# Altium schematic sheet Surf5.SchDoc
size A3; SheetNumber: 1; SheetTotal: 1
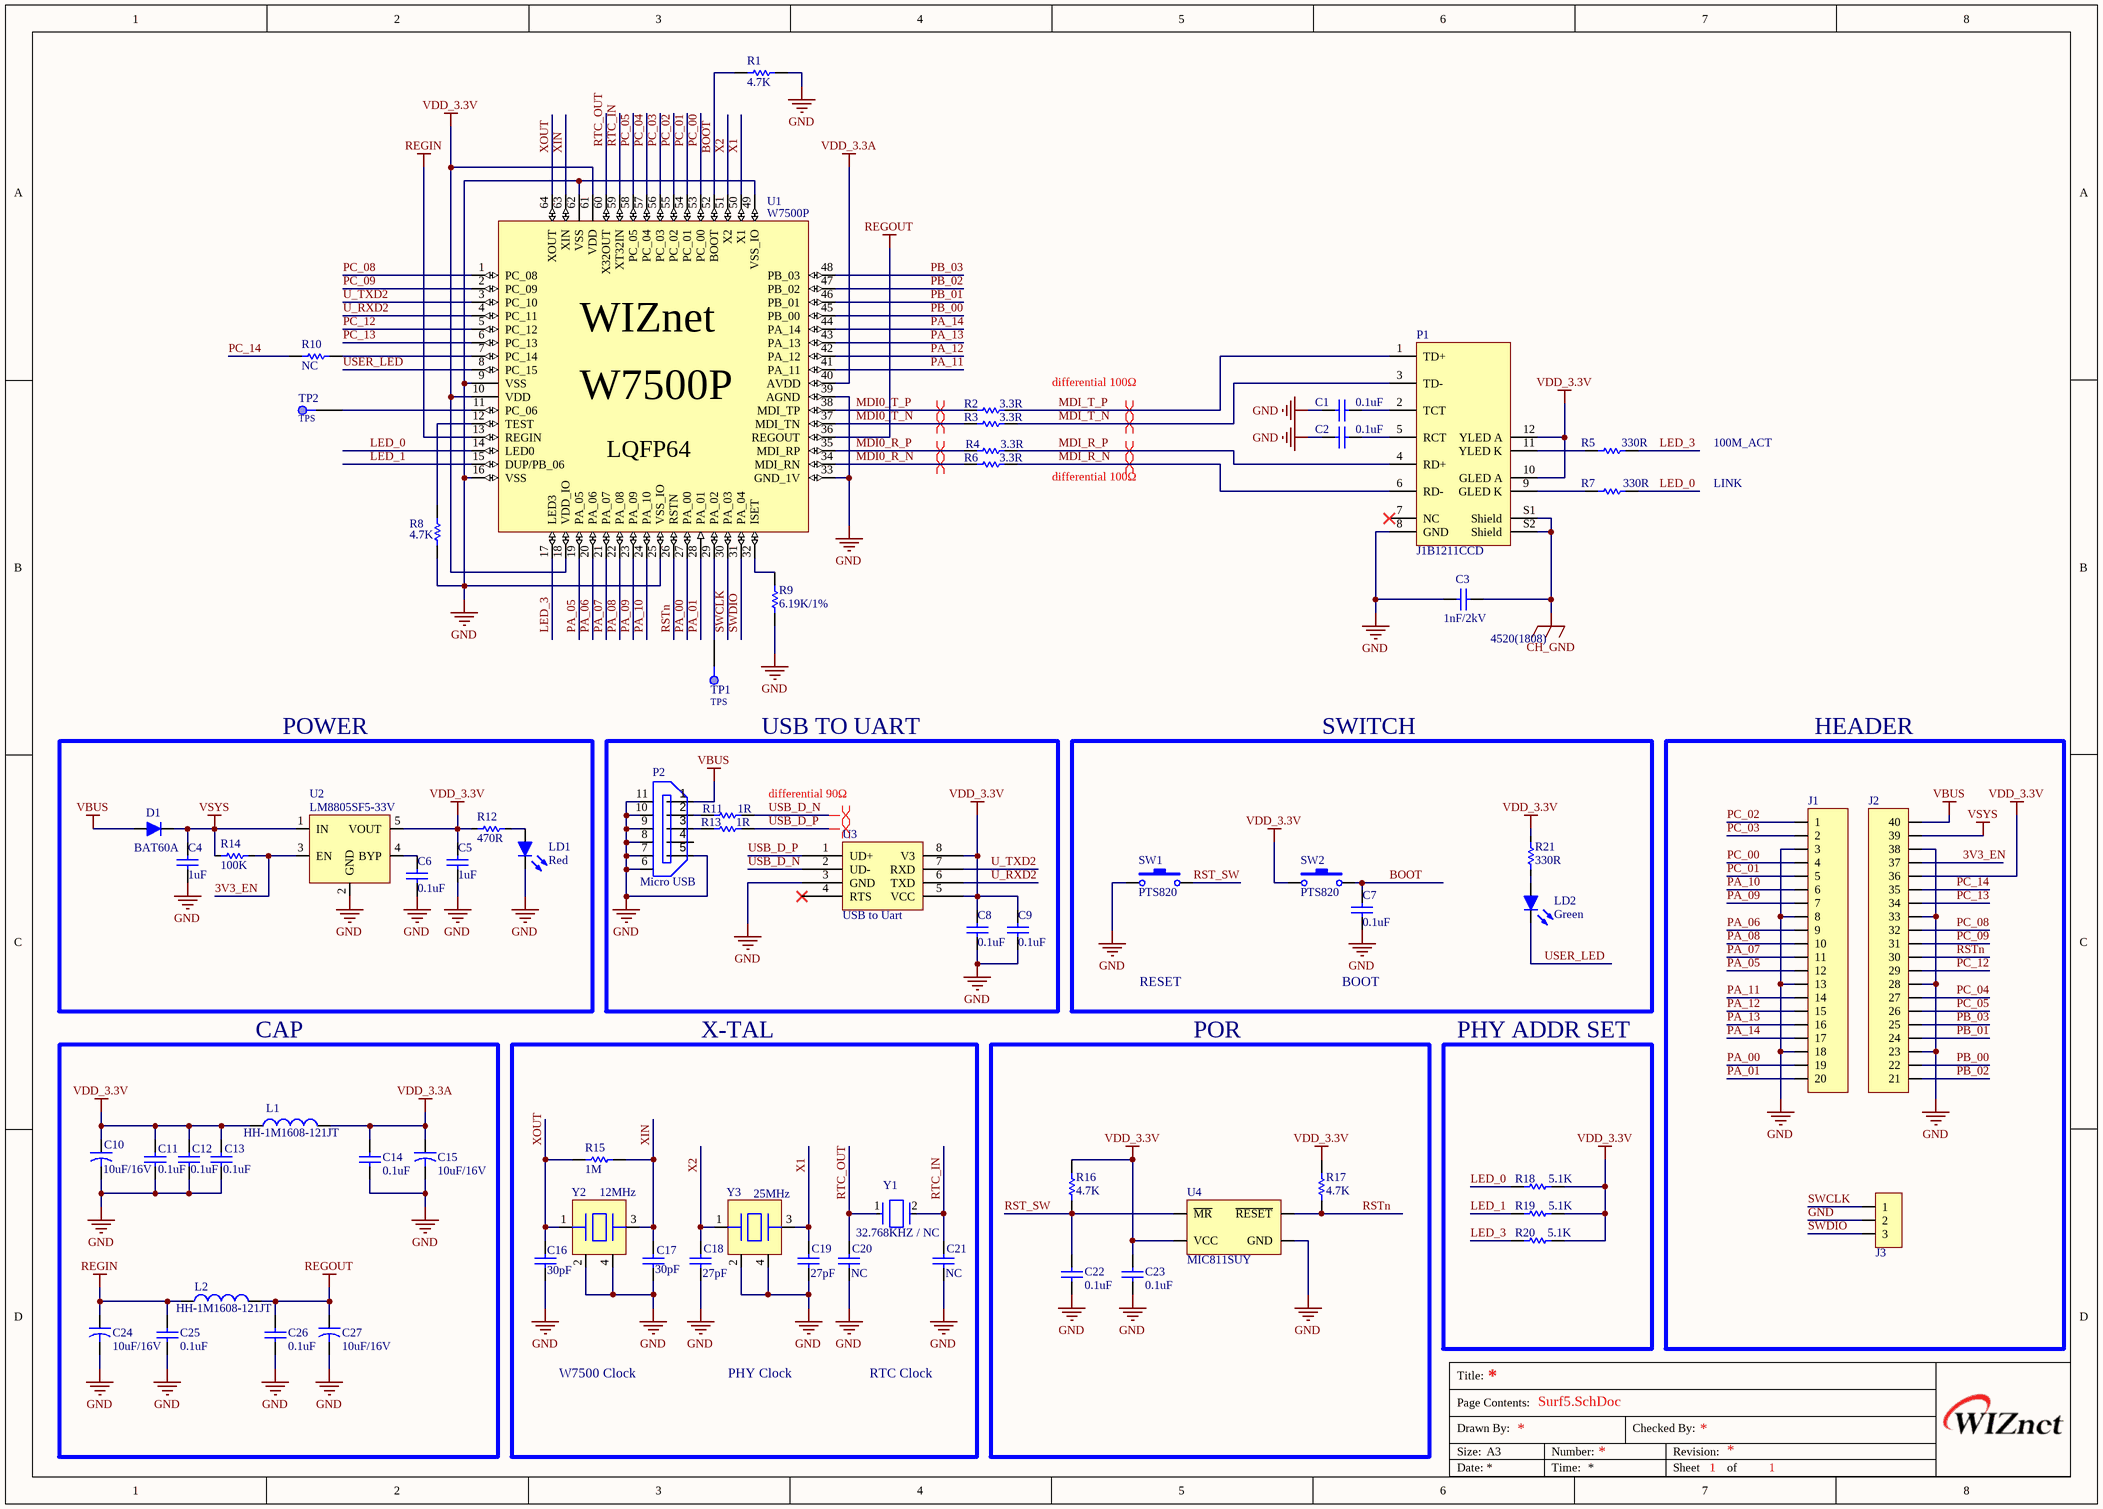
[diagram p0: Surf5.SchDoc]

## Parts
C1  0.1uF  [CAP-0402]
C2  0.1uF  [CAP-0402]
C3  1nF/2kV  [CAP-1808]
C4  1uF  [CAP-0402]
C5  1uF  [CAP-0402]
C6  0.1uF  [CAP-0402]
C7  0.1uF  [CAP-0402]
C8  0.1uF  [CAP-0402]
C9  0.1uF  [CAP-0402]
C10  10uF/16V  [CAP-A Size]
C11  0.1uF  [CAP-0402]
C12  0.1uF  [CAP-0402]
C13  0.1uF  [CAP-0402]
C14  0.1uF  [CAP-0402]
C15  10uF/16V  [CAP-A Size]
C16  30pF  [CAP-0402]
C17  30pF  [CAP-0402]
C18  27pF  [CAP-0402]
C19  27pF  [CAP-0402]
C20  NC  [CAP-0402]
C21  NC  [CAP-0402]
C22  0.1uF  [CAP-0402]
C23  0.1uF  [CAP-0402]
C24  10uF/16V  [CAP-A Size]
C25  0.1uF  [CAP-0402]
C26  0.1uF  [CAP-0402]
C27  10uF/16V  [CAP-A Size]
D1  BAT60A  [SOD-323(1-C,2-A)]
J1  2.54mm 1x20 Pin Header DIP  [IDC-1X20]  (value not drawn)
J2  2.54mm 1x20 Pin Header DIP  [IDC-1X20]  (value not drawn)
J3  2.54mm 1x3 Pin Header DIP  [idc-1x3]  (value not drawn)
L1  HH-1M1608-121JT  [IND-0603]
L2  HH-1M1608-121JT  [IND-0603]
LD1  Red  [LED-0603-RED]
LD2  Green  [LED-0603-RED]
P1  J1B1211CCD  [RJ45-J1B1211CCD]
P2  Micro USB  [Micro 5P B DBX 6.4]
R1  4.7K  [RES-0402]
R2  3.3R  [RES-0402]
R3  3.3R  [RES-0402]
R4  3.3R  [RES-0402]
R5  330R  [RES-0402]
R6  3.3R  [RES-0402]
R7  330R  [RES-0402]
R8  4.7K  [RES-0402]
R9  6.19K/1%  [RES-0402]
R10  NC  [RES-0402]
R11  1R  [RES-0402]
R12  470R  [RES-0402]
R13  1R  [RES-0402]
R14  100K  [RES-0402]
R15  1M  [RES-0402]
R16  4.7K  [RES-0402]
R17  4.7K  [RES-0402]
R18  5.1K  [RES-0402]
R19  5.1K  [RES-0402]
R20  5.1K  [RES-0402]
R21  330R  [RES-0402]
SW1  PTS820  [1185A]
SW2  PTS820  [1185A]
TP1  TPS  [TPS]
TP2  TPS  [TPS]
U1  W7500P  [W7500-LQFP64]
U2  LM8805SF5-33V  [SOT-23-5L]
U3  USB to Uart  [CH340N]
U4  MIC811SUY  [SOT-143]
Y1  32.768KHZ / NC  [3215_XTAL]
Y2  12MHz  [OSC-TZ1067B]
Y3  25MHz  [OSC-82J0626]

## Blocks framed on the sheet
POWER: C4-C6 D1 LD1 R12 R14 U2
USB TO UART: C8 C9 P2 R11 R13 U3
SWITCH: C7 LD2 R21 SW1 SW2
HEADER: J1-J3
CAP: C10-C15 C24-C27 L1 L2
X-TAL: C16-C21 R15 Y1-Y3
POR: C22 C23 R16 R17 U4
PHY ADDR SET: R18-R20

## Nets
CH_GND: C3.2 P1.S1(Shield) P1.S2(Shield)
GND: C1.1 C2.1 C3.1 C4.1 C5.1 C6.1 C7.1 C8.1 C9.1 C10.2 C11.1 C12.1 C13.1 C14.1 C15.2 C16.1 C17.1 C18.1 C19.1 C20.1 C21.1 C22.2 C23.2 C24.2 C25.1 C26.1 C27.2 J1.3 J1.8 J1.13 J1.18 J2.3(23) J2.8(28) J2.13(33) J2.18(38) J3.2 LD1.2(K) P1.8(GND) P2.5 P2.6 P2.7 P2.8 P2.9 P2.10 P2.11 R1.1 R8.1 R9.1 SW1.1 U1.9(VSS) U1.16(VSS) U1.25(VSS_IO) U1.33(GND_1V) U1.39(AGND) U1.49(VSS_IO) U1.62(VSS) U2.2(GND) U3.3(GND) U4.1(GND) Y2.2 Y2.4 Y3.2 Y3.4
REGIN: C24.1 C25.2 L2.1 U1.13(REGIN)
REGOUT: C26.2 C27.1 L2.2 U1.36(REGOUT)
VBUS: D1.2(A) J2.20(40) P2.1
VDD_3.3A: C14.2 C15.1 L1.2 U1.40(AVDD)
VDD_3.3V: C5.2 C8.2 C9.2 C10.1 C11.2 C12.2 C13.2 C23.1 J2.16(36) L1.1 P1.10(GLED_A) P1.12(YLED_A) R12.1 R16.2 R17.1 R18.2 R19.2 R20.2 R21.2 SW2.1 U1.10(VDD) U1.18(VDD_IO) U1.61(VDD) U2.5(VOUT) U3.5(VCC) U3.8(V3) U4.4(VCC)
VSYS: C4.2 D1.1(K) J2.19(39) R14.1 U2.1(IN)
3V3_EN: J2.17(37) R14.2 U2.3(EN)
BOOT: C7.2 R1.2 SW2.2 U1.52(BOOT)
LED_0: R7.2 R18.1 U1.14(LED0)
LED_1: R19.1 U1.15(DUP/PB_06)
LED_3: R5.2 R20.1 U1.17(LED3)
MDI0_R_N: R6.1 U1.34(MDI_RN)
MDI0_R_P: R4.1 U1.35(MDI_RP)
MDI0_T_N: R3.1 U1.37(MDI_TN)
MDI0_T_P: R2.1 U1.38(MDI_TP)
MDI_R_N: P1.6(RD-) R6.2
MDI_R_P: P1.4(RD+) R4.2
MDI_T_N: P1.3(TD-) R3.2
MDI_T_P: P1.1(TD+) R2.2
PA_00: J1.19 U1.27(PA_00)
PA_01: J1.20 U1.28(PA_01)
PA_05: J1.12 U1.19(PA_05)
PA_06: J1.9 U1.20(PA_06)
PA_07: J1.11 U1.21(PA_07)
PA_08: J1.10 U1.22(PA_08)
PA_09: J1.7 U1.23(PA_09)
PA_10: J1.6 U1.24(PA_10)
PA_11: J1.14 U1.41(PA_11)
PA_12: J1.15 U1.42(PA_12)
PA_13: J1.16 U1.43(PA_13)
PA_14: J1.17 U1.44(PA_14)
PB_00: J2.2(22) U1.45(PB_00)
PB_01: J2.4(24) U1.46(PB_01)
PB_02: J2.1(21) U1.47(PB_02)
PB_03: J2.5(25) U1.48(PB_03)
PC_00: J1.4 U1.53(PC_00)
PC_01: J1.5 U1.54(PC_01)
PC_02: J1.1 U1.55(PC_02)
PC_03: J1.2 U1.56(PC_03)
PC_04: J2.7(27) U1.57(PC_04)
PC_05: J2.6(26) U1.58(PC_05)
PC_08: J2.12(32) U1.1(PC_08)
PC_09: J2.11(31) U1.2(PC_09)
PC_12: J2.9(29) U1.5(PC_12)
PC_13: J2.14(34) U1.6(PC_13)
PC_14: J2.15(35) R10.1
RST_SW: C22.1 R16.1 SW1.2 U4.3(~{MR})
RSTn: J2.10(30) R17.2 U1.26(RSTN) U4.2(~{RESET})
RTC_IN: C21.2 U1.59(XT32IN) Y1.2
RTC_OUT: C20.2 U1.60(X32OUT) Y1.1
SWCLK: J3.1 U1.30(PA_03)
SWDIO: J3.3 U1.31(PA_04)
U_RXD2: U1.4(PC_11) U3.6(TXD)
U_TXD2: U1.3(PC_10) U3.7(RXD)
USB_D_N: R11.2 U3.2(UD-)
USB_D_P: R13.2 U3.1(UD+)
USER_LED: LD2.2(K) U1.8(PC_15)
X1: C19.2 U1.50(X1) Y3.3
X2: C18.2 U1.51(X2) Y3.1
XIN: C17.2 R15.2 U1.63(XIN) Y2.3
XOUT: C16.2 R15.1 U1.64(XOUT) Y2.1
NetC1_2: C1.2 P1.2(TCT)
NetC2_2: C2.2 P1.5(RCT)
NetC6_2: C6.2 U2.4(BYP)
NetLD1_1: LD1.1(A) R12.2
NetLD2_1: LD2.1(A) R21.1
NetP1_9: P1.9(GLED_K) R7.1
NetP1_11: P1.11(YLED_K) R5.1
NetP2_2: P2.2 R11.1
NetP2_3: P2.3 R13.1
NetR8_2: R8.2 U1.12(TEST)
NetR9_2: R9.2 U1.32(ISET)
NetR10_2: R10.2 U1.7(PC_14)
NetTP1_1: TP1.1 U1.29(PA_02)
NetTP2_1: TP2.1 U1.11(PC_06)

Not connected (* = marked no-connect by the designer): P1 7(NC)*; P2 4; U3 4(RTS)*

## Layout directives
differential pair: MDI0_R_N, MDI0_R_P, MDI0_T_N, MDI0_T_P, MDI_R_N, MDI_R_P, MDI_T_N, MDI_T_P, USB_D_N, USB_D_P

## Notes on the sheet
- differential 100Ω
- 100M_ACT
- LINK
- (near C3) 4520(1808)
- differential 90Ω
- RESET
- BOOT
- W7500 Clock
- PHY Clock
- RTC Clock
- Title:
- Page Contents:
- Size:
- Date:
- Drawn By:
- A3
- Number:
- Time:
- Checked By:
- Revision:
- Sheet
- of
- (in symbol W7500P) WIZnet; LQFP64

## Library data of the parts
C1 C2 C4-C9 C11-C14 C16-C23 C25 C26 = CAP-0402: Ceramic CAP 0402(1005)
C3 = CAP-1808: Ceramic CAP 1808(4520)
C10 C15 C24 C27 = CAP-A Size: Tantla CAP A Size EIA/IECQ 3216
D1 = DIODE-BAT60A: Silicon Schottky Diode
L1 L2 = IND-0603: Inductor 0603(1608)
LD1 LD2 = LED-0603
P2 = Micro USB 5P DBX6.4: Micro USB B Connector SMD
R1-R21 = RES-0402
SW1 SW2 = ITS-1107(SMD): TACT Switch (SMD)
TP1 TP2 = TPS: Test_point; Manufacturer: Wurth Elektronik; Part Number: 61300211121; Rated Current: 3A; Gender: Male; Withstanding Voltage: 500VAC; Working Voltage: 250VAC; Pitch: 2.54mm; Contact Resistance: 20mOhm; Row Number: Single; Pin Number: 2; Mounting Technology: THT; Orientation: Vertical; Operating Temperature: -40to105degC; Packaging: Bag; Publisher: WurthElektronik; Datasheet URL: https://katalog.we-online.de/em/datasheet/6130xx11121.pdf; Manufacturer URL: http://www.we-online.de; Package Reference: 61300211121
U1 = W7500P: WIZnet ARM Cortex-M0, Add PHY
U2 = LM8805SF5-33V: 600mA CMOS LDO Regulator
U3 = CH340N
U4 = MIC811SUY: Microprocessor Reset Circuits
Y1 = XTAL 3215: CRYSTAL 32.7680KHZ 6PF SMD; Frequency Tolerance: 20ppm; Series Resistance: 60kR; ESR (Equivalent Series Resistance): 55kR; Depth: 1.5mm; Width: 0.061inch; Number of Pins: 2; Max Operating Temperature: 85°C; Length: 3.2mm; Case/Package: SMD/SMT; Series: ABS07; Lead Free: Lead Free; Min Operating Temperature: -40°C; Load Capacitance: 6pF; Packaging: Tape and Reel; Height: 0.035inch; Radiation Hardening: No; Tolerance: 20ppm; Operating Frequency: 32.768 kHz; Termination: SMD/SMT; REACH SVHC: No SVHC; RoHS Compliant: Yes; Frequency: 32.768kHz; Package Quantity: 3000; Mount: Surface Mount
Y2 = OSC-TZ1067B-12MHz: X-tal 12MHz,3.2x2.5 SMD, CL=20pF
Y3 = OSC-82J0626-25MHz: X-tal 25MHz,3.2x2.5 SMD, CL=18pF